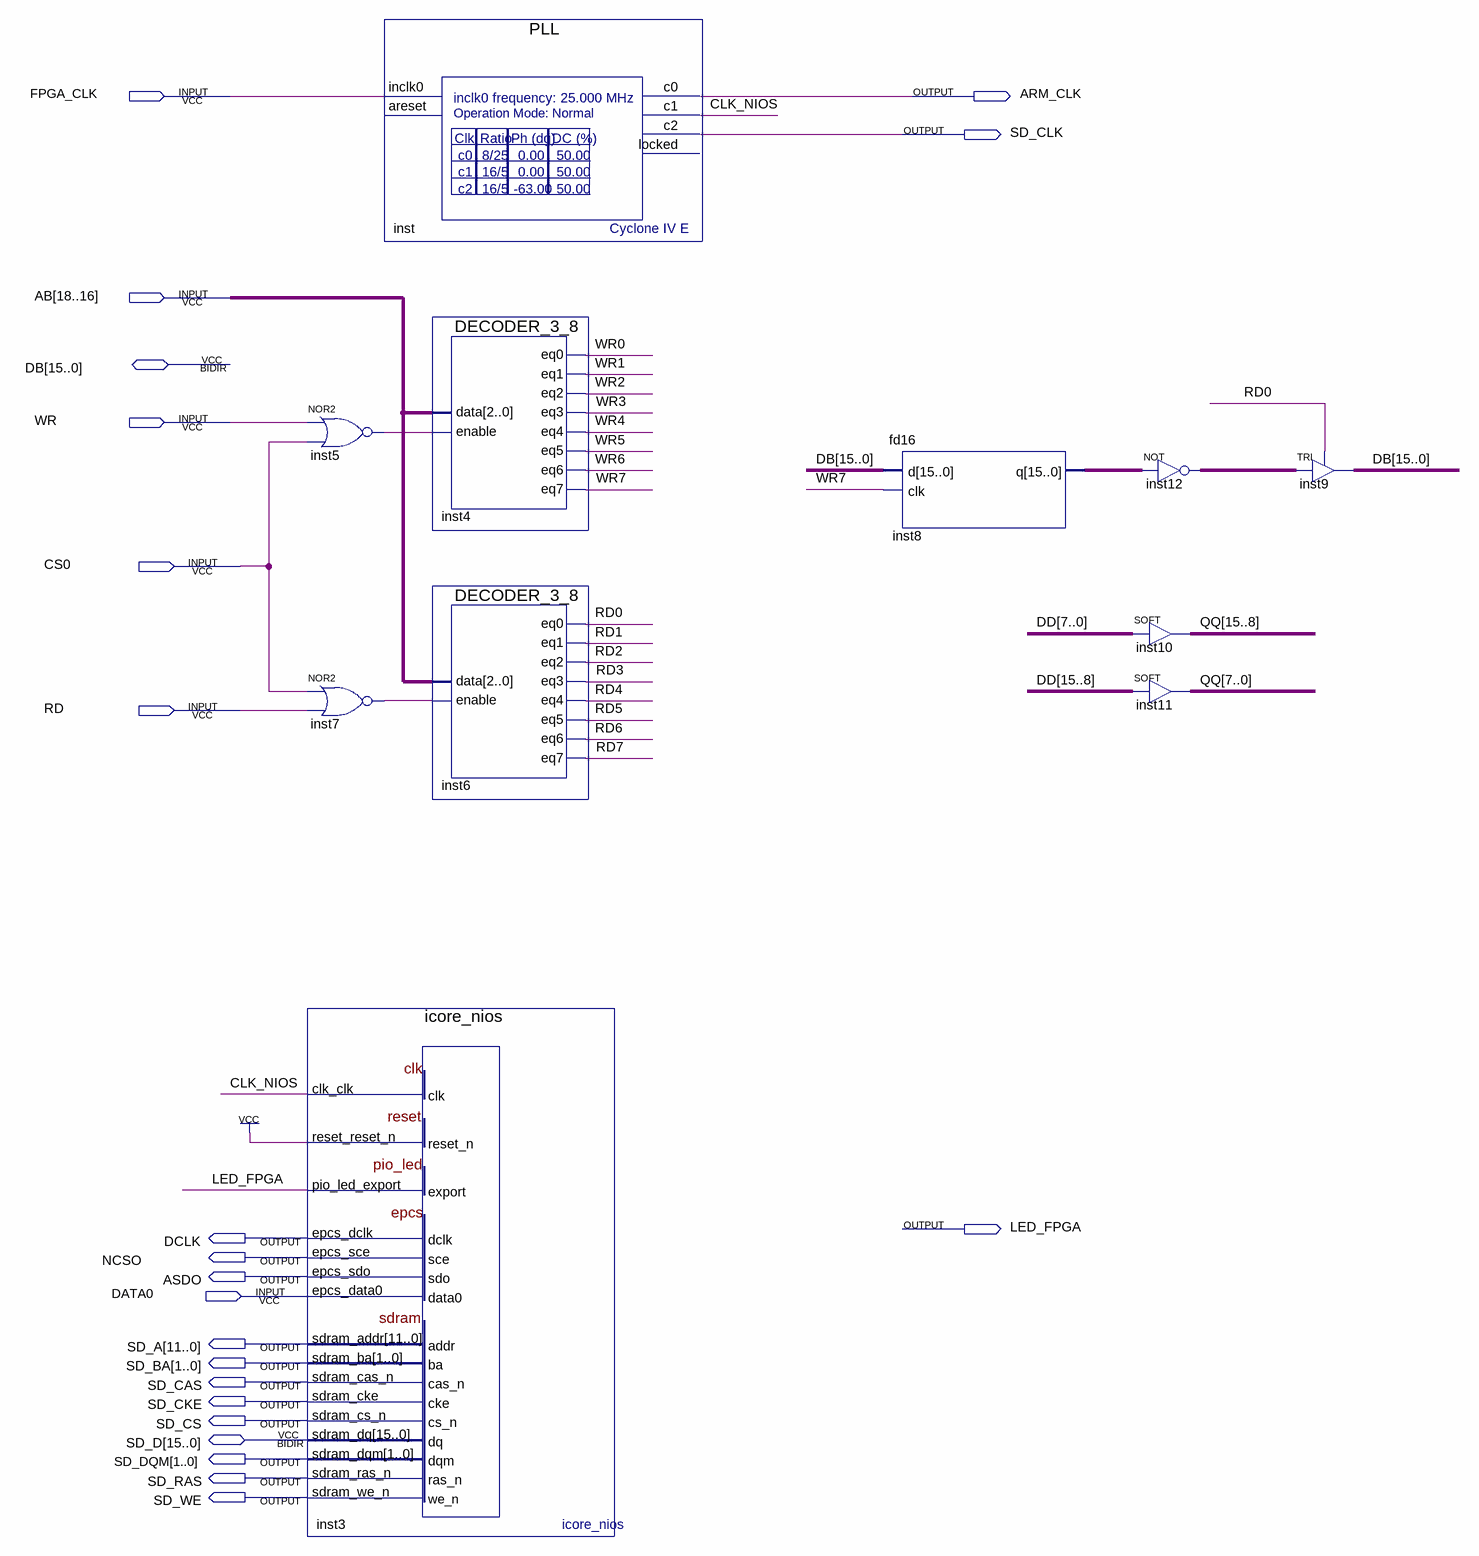
[diagram p0: schematic sheet]
// Quartus schematic ICORE.bdf as structural Verilog: 11 symbols, 22 pins
module ICORE (
  input  FPGA_CLK,
  input  [18:16] AB,
  input  WR,
  input  CS0,
  input  RD,
  input  DATA0,
  inout  [15:0] DB,
  inout  [15:0] SD_D,
  output ARM_CLK,
  output SD_CLK,
  output LED_FPGA,
  output DCLK,
  output NCSO,
  output ASDO,
  output [11:0] SD_A,
  output [1:0] SD_BA,
  output SD_CAS,
  output SD_CKE,
  output SD_CS,
  output [1:0] SD_DQM,
  output SD_RAS,
  output SD_WE
);

  wire CLK_NIOS, inst5_out, inst7_out, RD0, RD1, RD2, RD3, RD4, RD5, RD6, RD7, WR0, WR1, WR2, WR3, WR4, WR5,
       WR6, WR7;
  wire [15:0] DD, inst8_q, inst12_out, QQ;

  nor inst5 (inst5_out, WR, CS0);
  nor inst7 (inst7_out, CS0, RD);
  icore_nios inst3 (
    .clk_clk(CLK_NIOS), .reset_reset_n(1'b1), .epcs_data0(DATA0), .pio_led_export(LED_FPGA),
    .epcs_dclk(DCLK), .epcs_sce(NCSO), .epcs_sdo(ASDO), .sdram_addr(SD_A), .sdram_ba(SD_BA),
    .sdram_cas_n(SD_CAS), .sdram_cke(SD_CKE), .sdram_cs_n(SD_CS), .sdram_dqm(SD_DQM), .sdram_ras_n(SD_RAS),
    .sdram_we_n(SD_WE), .sdram_dq(SD_D));
  PLL inst (.inclk0(FPGA_CLK), .c0(ARM_CLK), .c1(CLK_NIOS), .c2(SD_CLK));  // open: areset, locked
  DECODER_3_8 inst4 (
    .data(AB), .enable(inst5_out), .eq0(WR0), .eq1(WR1), .eq2(WR2), .eq3(WR3), .eq4(WR4), .eq5(WR5),
    .eq6(WR6), .eq7(WR7));
  DECODER_3_8 inst6 (
    .data(AB), .enable(inst7_out), .eq0(RD0), .eq1(RD1), .eq2(RD2), .eq3(RD3), .eq4(RD4), .eq5(RD5),
    .eq6(RD6), .eq7(RD7));
  fd16 inst8 (.d(DB), .clk(WR7), .q(inst8_q));
  assign inst12_out = ~inst8_q;  // NOT inst12, 16 bits wide
  SOFT inst10[7:0] (.IN(DD[7:0]), .OUT(QQ[15:8]));
  SOFT inst11[7:0] (.IN(DD[15:8]), .OUT(QQ[7:0]));
  TRI inst9[15:0] (.IN(inst12_out), .OE(RD0), .OUT(DB));
endmodule
